# Altium schematic sheet FilterBoard.Schematic.SchDoc
size B
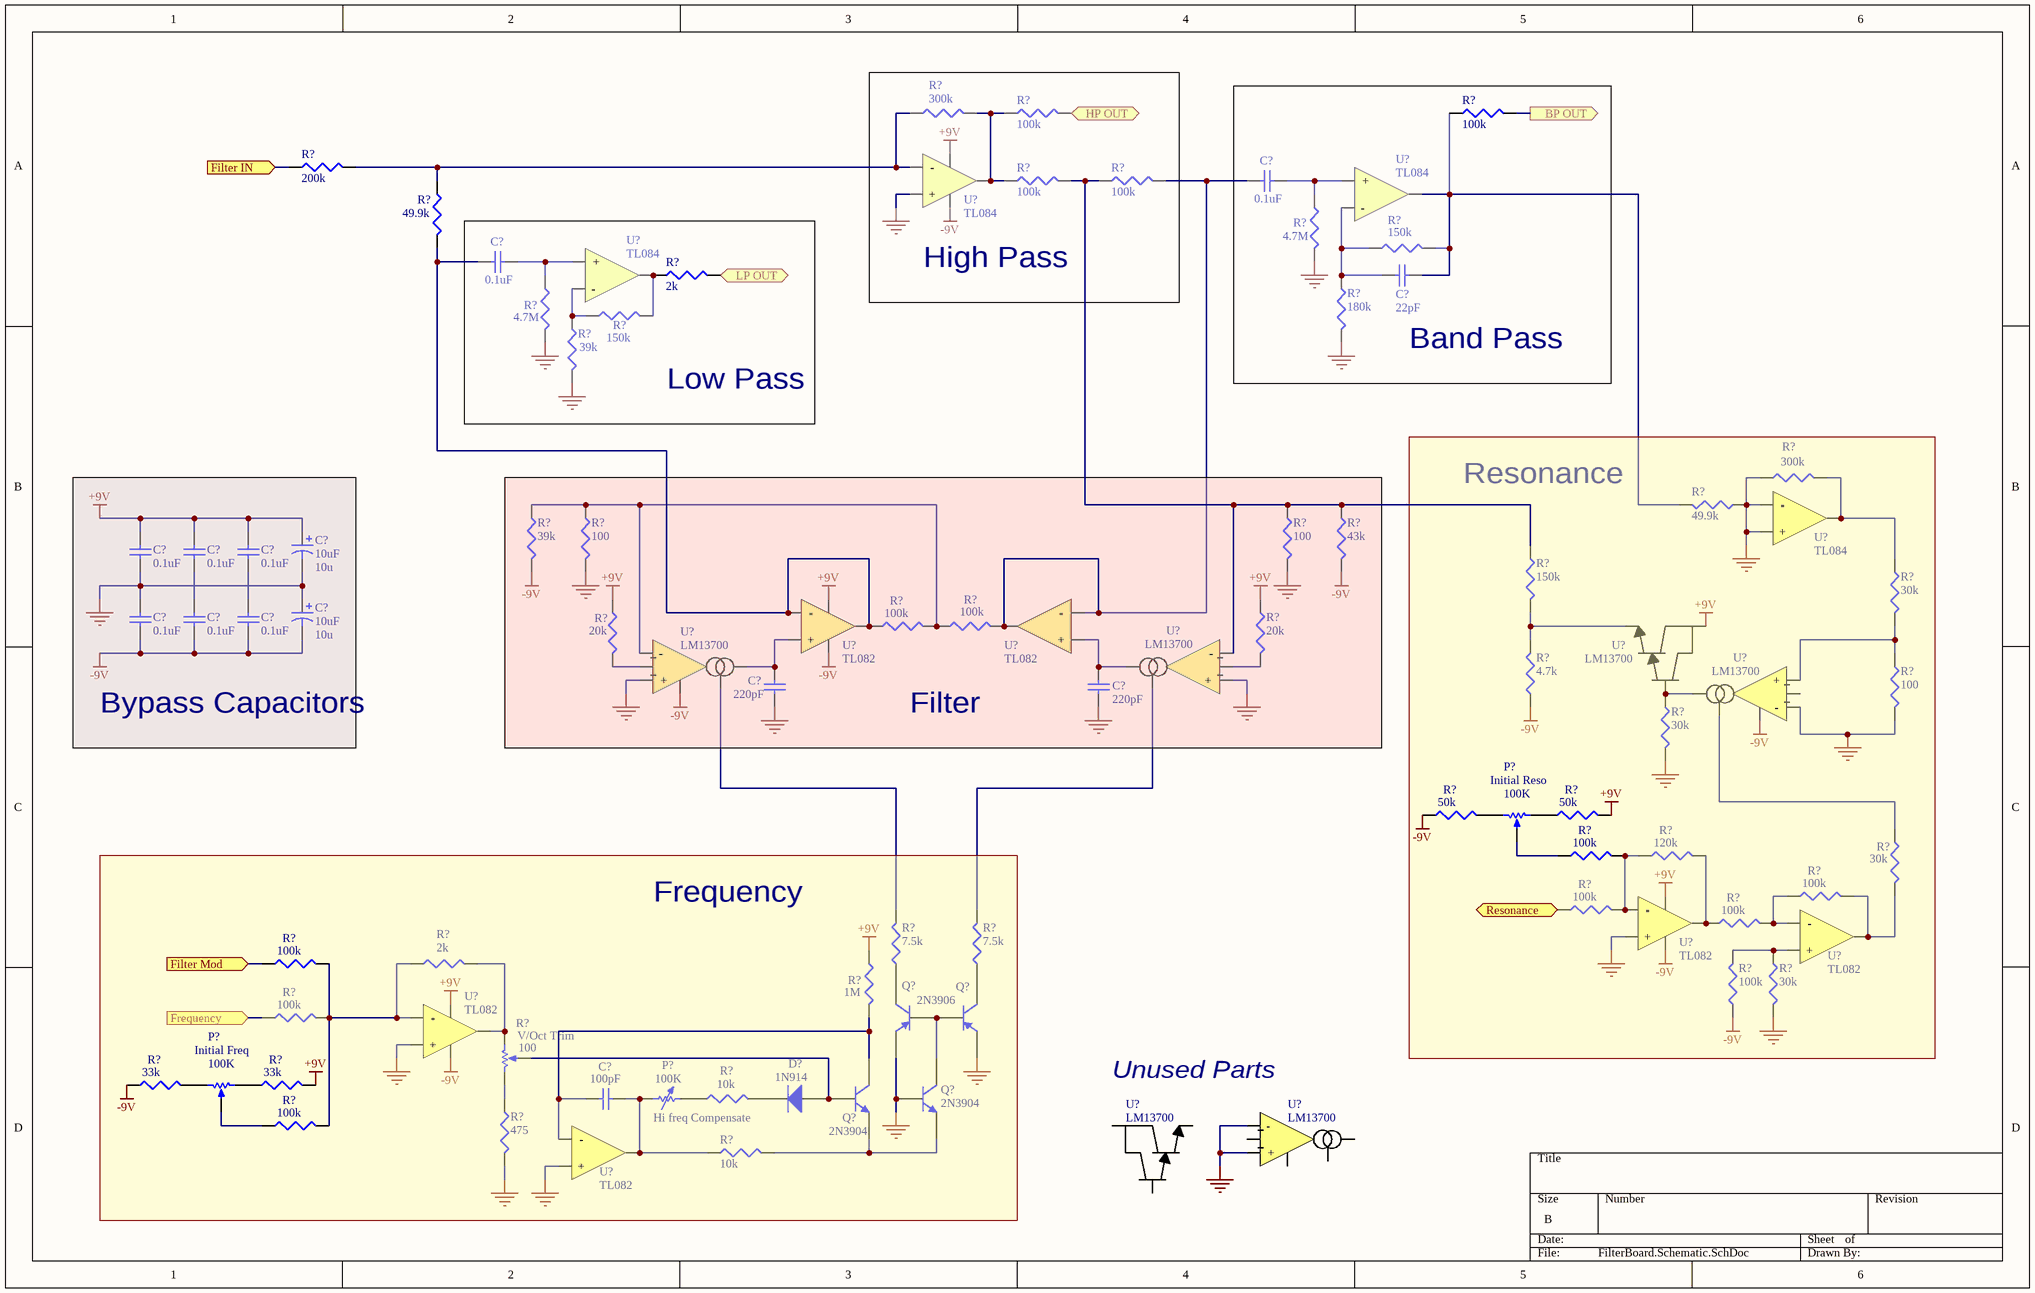
[diagram p0: FilterBoard.Schematic.SchDoc]

## Parts
(Parts that share a designator on the sheet are numbered #1, #2 ... from top to bottom, then left to right.)
C?#1  0.1uF  [C1206]
C?#2  0.1uF  [C1206]
C?#3  22pF  [C1206]
C?#4  10uF  value 10u  [RB7.6-15]
C?#5  0.1uF  [C1206]
C?#6  0.1uF  [C1206]
C?#7  0.1uF  [C1206]
C?#8  10uF  value 10u  [RB7.6-15]
C?#9  0.1uF  [C1206]
C?#10  0.1uF  [C1206]
C?#11  0.1uF  [C1206]
C?#12  220pF  [C1206]
C?#13  220pF  [C1206]
C?#14  100pF  [C1206]
D?  1N914  [DO-41]
P?#1  Initial Reso  value 100K  [VR5]
P?#2  Hi freq Compensate  value 100K  [AXIAL-0.7]
P?#3  Initial Freq  value 100K  [VR5]
Q?#1  2N3906  [TO-92A]
Q?#2  2N3906  [TO-92A]  (value not drawn)
Q?#3  2N3904  [TO-92A]
Q?#4  2N3904  [TO-92A]
R?#1  300k  [J1-0603]
R?#2  100k  [J1-0603]
R?#3  100k  [J1-0603]
R?#4  200k  [J1-0603]
R?#5  100k  [J1-0603]
R?#6  100k  [J1-0603]
R?#7  49.9k  [J1-0603]
R?#8  4.7M  [J1-0603]
R?#9  150k  [J1-0603]
R?#10  2k  [J1-0603]
R?#11  4.7M  [J1-0603]
R?#12  180k  [J1-0603]
R?#13  150k  [J1-0603]
R?#14  39k  [J1-0603]
R?#15  300k  [J1-0603]
R?#16  39k  [J1-0603]
R?#17  100  [J1-0603]
R?#18  100  [J1-0603]
R?#19  43k  [J1-0603]
R?#20  49.9k  [J1-0603]
R?#21  150k  [J1-0603]
R?#22  30k  [J1-0603]
R?#23  20k  [J1-0603]
R?#24  100k  [J1-0603]
R?#25  100k  [J1-0603]
R?#26  20k  [J1-0603]
R?#27  100  [J1-0603]
R?#28  4.7k  [J1-0603]
R?#29  30k  [J1-0603]
R?#30  50k  [J1-0603]
R?#31  50k  [J1-0603]
R?#32  100k  [J1-0603]
R?#33  120k  [J1-0603]
R?#34  30k  [J1-0603]
R?#35  100k  [J1-0603]
R?#36  100k  [J1-0603]
R?#37  100k  [J1-0603]
R?#38  100k  [J1-0603]
R?#39  2k  [J1-0603]
R?#40  7.5k  [J1-0603]
R?#41  1M  [J1-0603]
R?#42  7.5k  [J1-0603]
R?#43  30k  [J1-0603]
R?#44  100k  [J1-0603]
R?#45  100k  [J1-0603]
R?#46  V/Oct Trim  value 100  [VR5]
R?#47  33k  [J1-0603]
R?#48  33k  [J1-0603]
R?#49  10k  [J1-0603]
R?#50  100k  [J1-0603]
R?#51  475  [J1-0603]
R?#52  10k  [J1-0603]
U?#1  TL084
U?#2  TL084
U?#3  TL084
U?#4  TL084
U?#5  TL082
U?#6  TL082
U?#7  LM13700
U?#8  LM13700
U?#9  LM13700
U?#10  LM13700
U?#11  TL082
U?#12  TL082
U?#13  TL082
U?#14  LM13700
U?#15  TL082
U?#16  LM13700

## Blocks framed on the sheet
High Pass: R?#1 R?#2 R?#5 R?#6 U?#1
Band Pass: C?#1 C?#3 R?#3 R?#8 R?#9 R?#12 U?#2
Low Pass: C?#2 R?#10 R?#11 R?#13 R?#14 U?#3
Resonance: P?#1 R?#15 R?#20-R?#22 R?#27-R?#37 R?#43 R?#45 U?#4 U?#9-U?#12
Bypass Capacitors: C?#4-C?#11
Filter: C?#12 C?#13 R?#16-R?#19 R?#23-R?#26 U?#5-U?#8
Frequency: C?#14 D? P?#2 P?#3 Q?#1-Q?#4 R?#38-R?#42 R?#44 R?#46-R?#52 U?#13 U?#15

## Ports
BP OUT (out), Filter IN (in), Filter Mod (in), Frequency (in), HP OUT (out), LP OUT (out), Resonance (in)

## Nets
+9V: C?#4.1 C?#5.2 C?#6.2 C?#7.2 R?#23.1 R?#26.1 R?#31.2 R?#41.1 R?#48.2 U?#1.4(VCC+) U?#5.8(VCC+) U?#9.11(V+) U?#11.8(VCC+) U?#13.8(VCC+)
-9V: C?#8.2 C?#9.1 C?#10.1 C?#11.1 R?#16.2 R?#19.2 R?#28.1 R?#30.1 R?#45.1 R?#47.1 U?#1.11(VCC-) U?#5.4(VCC-) U?#7.6(VCC-) U?#10.6(VCC-) U?#11.4(VCC-) U?#13.4(VCC-)
GND: C?#4.2 C?#5.1 C?#8.1 C?#9.2 C?#12.1 C?#13.1 Q?#1.1(E) Q?#2.1(E) Q?#4.2(B) R?#8.2 R?#11.2 R?#12.2 R?#14.2 R?#15.1 R?#17.2 R?#18.2 R?#20.1 R?#27.2 R?#29.2 R?#43.2 R?#51.2 U?#1.3(+) U?#4.12(-) U?#4.13(+) U?#7.3(+) U?#8.3(+) U?#10.3(-) U?#11.3(+) U?#13.3(+) U?#14.3(+) U?#14.4(-) U?#15.5(+)
BP OUT: R?#3.2 ; port BP OUT
Filter IN: R?#4.1 ; port Filter IN
Filter Mod: R?#38.1 ; port Filter Mod
Frequency: R?#44.1 ; port Frequency
HP OUT: R?#2.2 ; port HP OUT
LP OUT: R?#10.2 ; port LP OUT
Resonance: R?#36.1 ; port Resonance
NetC?#1_1: C?#1.1 R?#6.2 R?#25.2 U?#6.6(-) U?#6.7(OUT)
NetC?#1_2: C?#1.2 R?#8.1 U?#2.5(+)
NetC?#2_1: C?#2.1 R?#7.2 R?#24.1 U?#5.1(OUT) U?#5.2(-)
NetC?#2_2: C?#2.2 R?#11.1 U?#3.5(+)
NetC?#3_1: C?#3.1 R?#9.1 R?#12.1 U?#2.3(-)
NetC?#3_2: C?#3.2 R?#3.1 R?#9.2 R?#20.2 U?#2.7(OUT)
NetC?#6_1: C?#6.1 C?#10.2
NetC?#7_1: C?#7.1 C?#11.2
NetC?#12_2: C?#12.2 U?#5.3(+) U?#7.5(OUT)
NetC?#13_2: C?#13.2 U?#6.5(+) U?#8.5(OUT)
NetC?#14_1: C?#14.1 Q?#3.3(C) R?#41.2 U?#15.6(-)
NetC?#14_2: C?#14.2 P?#2.1 R?#52.1 U?#15.7(OUT)
NetD?_1: D?.1(A) Q?#3.2(B) R?#46.3(TAP)
NetD?_2: D?.2(K) R?#49.2
NetP?#1_1: P?#1.1(TOP) R?#31.1
NetP?#1_2: P?#1.2(BOT) R?#30.2
NetP?#1_3: P?#1.3(TAP) R?#32.1
NetP?#2_2: P?#2.2 R?#49.1
NetP?#3_1: P?#3.1(TOP) R?#48.1
NetP?#3_2: P?#3.2(BOT) R?#47.2
NetP?#3_3: P?#3.3(TAP) R?#50.1
NetQ?#1_2: Q?#1.2(B) Q?#2.2(B) Q?#4.3(C)
NetQ?#1_3: Q?#1.3(C) R?#40.1
NetQ?#2_3: Q?#2.3(C) R?#42.1
NetQ?#3_1: Q?#3.1(E) Q?#4.1(E) R?#52.2
NetR?#1_1: R?#1.1 R?#4.2 R?#7.1 U?#1.2(-)
NetR?#1_2: R?#1.2 R?#2.1 R?#5.1 U?#1.1(OUT)
NetR?#5_2: R?#5.2 R?#6.1 R?#18.1 R?#19.1 R?#21.1 U?#8.4(-)
NetR?#10_1: R?#10.1 R?#13.2 U?#3.7(OUT)
NetR?#13_1: R?#13.1 R?#14.1 U?#3.3(-)
NetR?#15_2: R?#15.2 R?#22.1 U?#4.14(OUT)
NetR?#16_1: R?#16.1 R?#17.1 R?#24.2 R?#25.1 U?#7.4(-)
NetR?#21_2: R?#21.2 R?#28.2 U?#9.8(BOUT)
NetR?#22_2: R?#22.2 R?#27.1 U?#10.4(+)
NetR?#23_2: R?#23.2 U?#7.2
NetR?#26_2: R?#26.2 U?#8.2
NetR?#29_1: R?#29.1 U?#9.7(BIN) U?#10.5(OUT)
NetR?#32_2: R?#32.2 R?#33.1 R?#36.2 U?#11.2(-)
NetR?#33_2: R?#33.2 R?#37.1 U?#11.1(OUT)
NetR?#34_1: R?#34.1 U?#10.1(BIAS)
NetR?#34_2: R?#34.2 R?#35.2 U?#12.7(OUT)
NetR?#35_1: R?#35.1 R?#37.2 U?#12.6(-)
NetR?#38_2: R?#38.2 R?#39.1 R?#44.2 R?#50.2 U?#13.2(-)
NetR?#39_2: R?#39.2 R?#46.1(TOP) U?#13.1(OUT)
NetR?#40_2: R?#40.2 U?#7.1(BIAS)
NetR?#42_2: R?#42.2 U?#8.1(BIAS)
NetR?#43_1: R?#43.1 R?#45.2 U?#12.5(+)
NetR?#46_2: R?#46.2(BOT) R?#51.1

Not connected (* = marked no-connect by the designer): U?#2 6(VCC+) 11(VCC-); U?#3 6(VCC+) 11(VCC-); U?#4 1(VCC+) 11(VCC-); U?#6 4(VCC-) 8(VCC+); U?#8 6(VCC-); U?#10 2; U?#12 4(VCC-) 8(VCC+); U?#14 1(BIAS) 2 5(OUT) 6(VCC-); U?#15 4(VCC-) 8(VCC+); U?#16 7(BIN) 8(BOUT) 11(V+)

## Notes on the sheet
- (near U?#16) Unused Parts

## Library data of the parts
C?#1 C?#2 C?#5-C?#7 C?#9-C?#11 = Cap Semi: Capacitor (Semiconductor SIM Model); Value: 0.1u; Published: 8-Jun-2000; LatestRevisionDate: 29-May-2009; LatestRevisionNote: IPC-7351 Footprint Added.; PackageReference: C1206; Publisher: Altium Limited; PackageDescription: Chip Capacitor
C?#3 = Cap Semi: Capacitor (Semiconductor SIM Model); Value: 22p; Published: 8-Jun-2000; LatestRevisionDate: 29-May-2009; LatestRevisionNote: IPC-7351 Footprint Added.; PackageReference: C1206; Publisher: Altium Limited; PackageDescription: Chip Capacitor
C?#4 C?#8 = Cap Pol1: Polarized Capacitor (Radial); Published: 8-Jun-2000; LatestRevisionDate: 17-Jul-2002; LatestRevisionNote: Re-released for DXP Platform.; PackageReference: RB7.6-15; Publisher: Altium Limited; PackageDescription: Polarized Capacitor (Radial); 2 Leads
C?#12 C?#13 = Cap Semi: Capacitor (Semiconductor SIM Model); Value: 220p; Published: 8-Jun-2000; LatestRevisionDate: 29-May-2009; LatestRevisionNote: IPC-7351 Footprint Added.; PackageReference: C1206; Publisher: Altium Limited; PackageDescription: Chip Capacitor
C?#14 = Cap Semi: Capacitor (Semiconductor SIM Model); Value: 100p; Published: 8-Jun-2000; LatestRevisionDate: 29-May-2009; LatestRevisionNote: IPC-7351 Footprint Added.; PackageReference: C1206; Publisher: Altium Limited; PackageDescription: Chip Capacitor
D? = Diode 1N4001: 1 Amp General Purpose Rectifier; Published: 8-Jun-2000; LatestRevisionDate: 17-Jul-2002; LatestRevisionNote: Re-released for DXP Platform.; DatasheetVersion: 1998; PackageVersion: Aug-1999; PackageReference: DO-41; Publisher: Altium Limited; PackageDescription: Diode, Axial; Body 5.2 x 2.7 mm (LxDia. max), Lead Dia. 0.86 mm (max); Code_JEDEC: DO-204-AL; ComponentLink1Description: Manufacturer Link; ComponentLink1URL: http://www.fairchildsemi.com/; ComponentLink2Description: Datasheet; ComponentLink2URL: http://www.fairchildsemi.com/ds/1N%2F1N4001.pdf
P?#1 P?#3 R?#46 = RPot: Potentiometer; Sim Note: Enter the Resistance value and the set point into parameter fields.; Set Position: 0.5; Published: 8-Jun-2000; LatestRevisionDate: 17-Jul-2002; LatestRevisionNote: Re-released for DXP Platform.; PackageReference: VR5; Publisher: Altium Limited; PackageDescription: Variable Resistor, Thru-Hole; 3 Leads
P?#2 = Res Adj1: Variable Resistor; Set Position: 0.5; Published: 8-Jun-2000; LatestRevisionDate: 17-Jul-2002; LatestRevisionNote: Re-released for DXP Platform.; PackageReference: AXIAL-0.7; Publisher: Altium Limited; PackageDescription: Axial Device, Thru-Hole; 2 Leads; 0.7 in Pin Spacing
Q?#1 Q?#2 = 2N3906: PNP General Purpose Amplifier; Published: 8-Jun-2000; LatestRevisionDate: 15-Jan-2003; LatestRevisionNote: PCB Footprint 'BCY-W3/D4.7' replaced; DatasheetVersion: 1997; PackageVersion: Sep-1998; PackageReference: TO-92A; Publisher: Altium Limited; PackageDescription: TO, Flat Index; 3 In-Line, Axial Leads; Body Dia. 4.5mm; Leads 0.51 x 0.48 mm (max); ComponentLink1Description: Manufacturer Link; ComponentLink1URL: http://www.fairchildsemi.com/; ComponentLink2Description: Datasheet; ComponentLink2URL: http://www.fairchildsemi.com/ds/2N%2F2N3906.pdf
Q?#3 Q?#4 = 2N3904: NPN General Purpose Amplifier; Published: 8-Jun-2000; LatestRevisionDate: 15-Jan-2003; LatestRevisionNote: PCB Footprint 'BCY-W3/D4.7' replaced; DatasheetVersion: 1997; PackageVersion: Sep-1998; PackageReference: TO-92A; Publisher: Altium Limited; PackageDescription: TO, Flat Index; 3 In-Line, Axial Leads; Body Dia. 4.5mm; Leads 0.51 x 0.48 mm (max); ComponentLink1Description: Manufacturer Link; ComponentLink1URL: http://www.fairchildsemi.com/; ComponentLink2Description: Datasheet; ComponentLink2URL: http://www.fairchildsemi.com/ds/2N%2F2N3904.pdf
R?#1-R?#9 R?#11-R?#45 R?#47-R?#52 = Res3: Resistor; Published: 8-Jun-2000; LatestRevisionDate: 29-May-2009; LatestRevisionNote: IPC-7351 Footprint Added.; PackageReference: J1-0603; Publisher: Altium Limited; PackageDescription: Chip Resistor
  R?#1 R?#15: Value: 300K
  R?#2 R?#3 R?#5 R?#6 R?#24 R?#25 R?#32 R?#35-R?#38 R?#44 R?#45 R?#50: Value: 100K
  R?#4: Value: 200K
  R?#7 R?#20: Value: 49.9K
  R?#8 R?#11: Value: 4.7M
  R?#9 R?#13 R?#21: Value: 150K
  R?#12: Value: 180K
  R?#14 R?#16: Value: 39K
  R?#17 R?#18 R?#27: Value: 100
  R?#19: Value: 43K
  R?#22 R?#29 R?#34 R?#43: Value: 30K
  R?#23 R?#26: Value: 20K
  R?#28: Value: 4.7K
  R?#30 R?#31: Value: 50K
  R?#33: Value: 120K
  R?#39: Value: 2K
  R?#40 R?#42: Value: 7.5K
  R?#41: Value: 1M
  R?#47 R?#48: Value: 33K
  R?#49 R?#52: Value: 10K
  R?#51: Value: 475
R?#10 = Res3: Resistor; Value: 100K; Published: 8-Jun-2000; LatestRevisionDate: 29-May-2009; LatestRevisionNote: IPC-7351 Footprint Added.; PackageReference: J1-0603; Publisher: Altium Limited; PackageDescription: Chip Resistor
U?#9 U?#16 = LM13700_1